# EAGLE design shoulder (EAGLE 7.5.0)
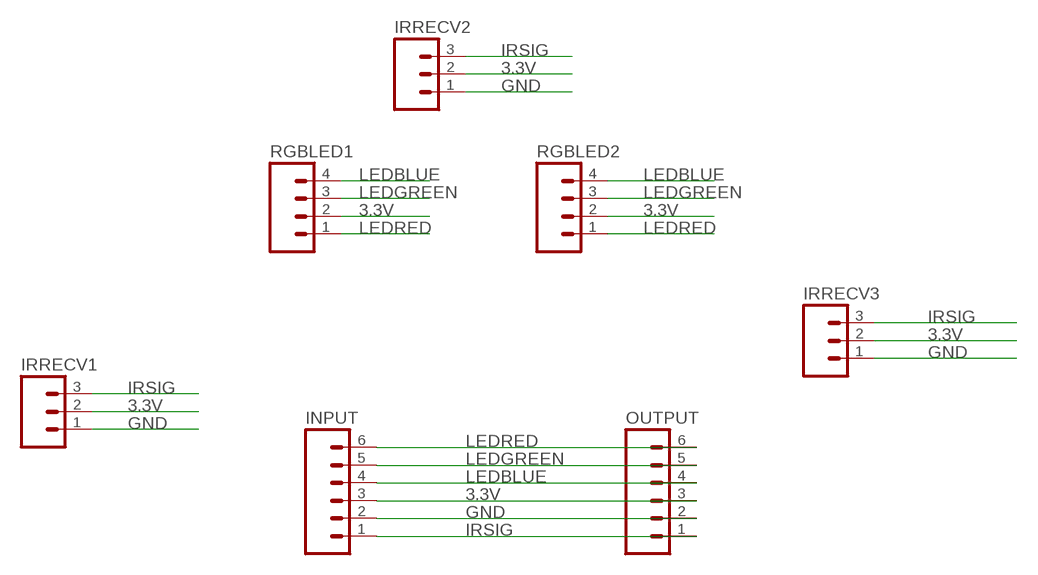
[diagram p0: schematic, sheet 1]

## Parts
INPUT  M06SILK_FEMALE_PTH  [1X06]
IRRECV1  M03PTH  [1X03]
IRRECV2  M03PTH  [1X03]
IRRECV3  M03PTH  [1X03]
OUTPUT  M06SILK_FEMALE_PTH  [1X06]
RGBLED1  M04PTH  [1X04]
RGBLED2  M04PTH  [1X04]

## Nets
3.3V: INPUT.3 IRRECV1.2 IRRECV2.2 IRRECV3.2 OUTPUT.3 RGBLED1.2 RGBLED2.2
GND: INPUT.2 IRRECV1.1 IRRECV2.1 IRRECV3.1 OUTPUT.2
IRSIG: INPUT.1 IRRECV1.3 IRRECV2.3 IRRECV3.3 OUTPUT.1
LEDBLUE: INPUT.4 OUTPUT.4 RGBLED1.4 RGBLED2.4
LEDGREEN: INPUT.5 OUTPUT.5 RGBLED1.3 RGBLED2.3
LEDRED: INPUT.6 OUTPUT.6 RGBLED1.1 RGBLED2.1

## Library data of the parts
INPUT OUTPUT = SparkFun-Connectors:M06: Header 6 Standard 6-pin 0.1" header. Use with straight break away headers (SKU : PRT-00116), right angle break away headers (PRT-00553), swiss pins (PRT-00743), machine pins (PRT-00117), and female headers (PRT-00115). Molex polarized connector foot print use with SKU : PRT-08094 with associated crimp pins and housings. NOTES ON THE VARIANTS LOCK and LOCK_LONGPADS... This footprint was designed to help hold the alignment of a through-hole component (i.e. 6-pin header) while soldering it into place. You may notice that each hole has been shifted either up or down by 0.005 of an inch from it's more standard position (which is a perfectly straight line). This slight alteration caused the pins (the squares in the middle) to touch the edges of the holes. Because they are alternating, it causes a "brace" to hold the component in place. 0.005 has proven to be the perfect amount of "off-center" position when using our standard breakaway headers. Although looks a little odd when you look at the bare footprint, once you have a header in there, the alteration is very hard to notice. Also,if you push a header all the way into place, it is covered up entirely on the bottom side. This idea of altering the position of holes to aid alignment will be further integrated into the Sparkfun Library for other footprints. It can help hold any component with 3 or more connection pins.; PROD_ID: CONN-08437
IRRECV1-IRRECV3 = SparkFun-Connectors:M03: Header 3 Standard 3-pin 0.1" header. Use with straight break away headers (SKU : PRT-00116), right angle break away headers (PRT-00553), swiss pins (PRT-00743), machine pins (PRT-00117), and female headers (PRT-00115). Molex polarized connector foot print use with SKU : PRT-08232 with associated crimp pins and housings.
RGBLED1 RGBLED2 = SparkFun-Connectors:M04: Header 4 Standard 4-pin 0.1" header. Use with straight break away headers (SKU : PRT-00116), right angle break away headers (PRT-00553), swiss pins (PRT-00743), machine pins (PRT-00117), and female headers (PRT-00115). Molex polarized connector foot print use with SKU : PRT-08231 with associated crimp pins and housings. 1MM SMD Version SKU: PRT-10208; PROD_ID: CONN-09696

## Net classes
0 default: width 0.406 mm, drill 0.381 mm, clearance 0.305 mm

## Board
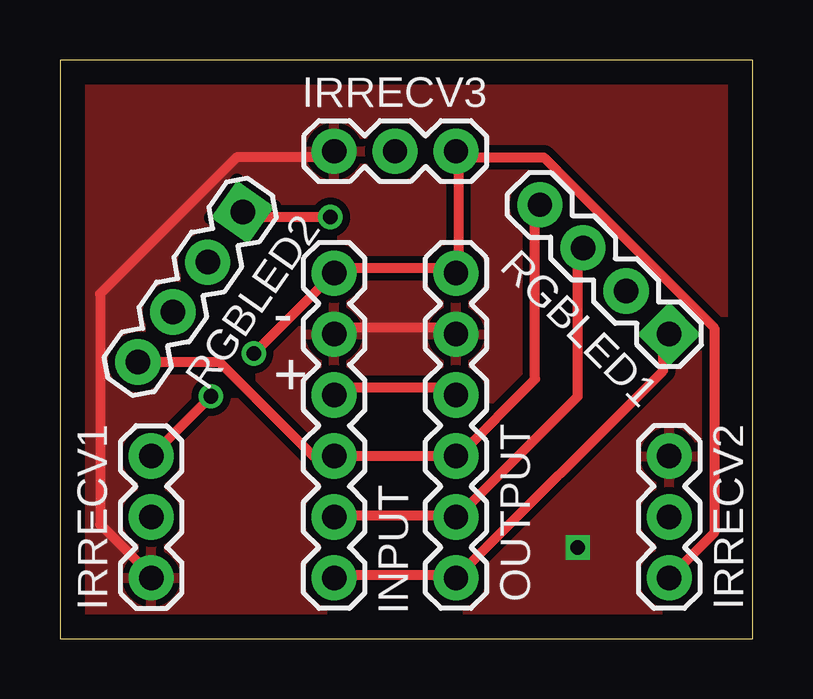
[diagram p1: board, top side]
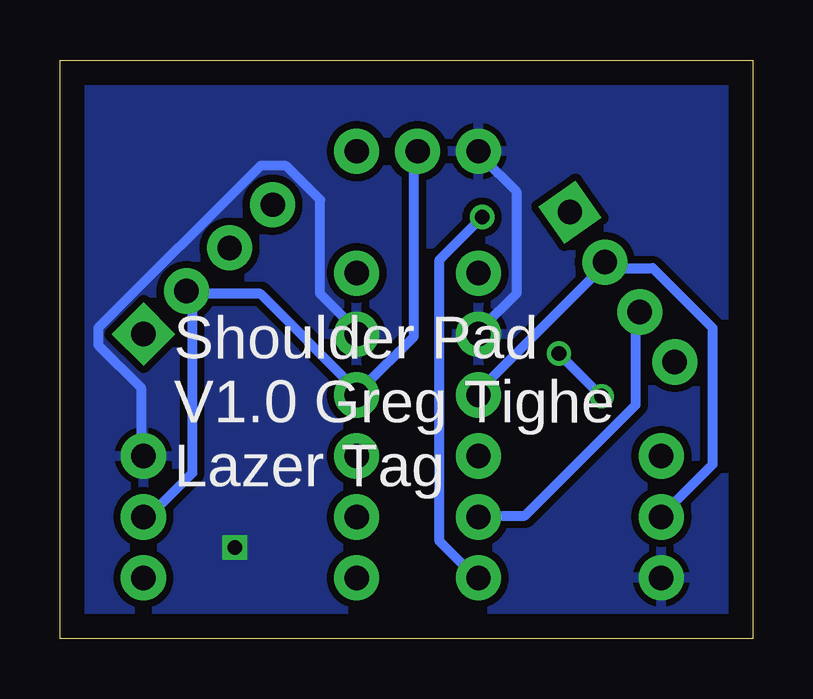
[diagram p2: board, bottom side, seen from below]

Size 28.88 x 24.12 mm. Coordinates in mm from the lower left corner, seen from the top.
Outline: 0,0 28.88,0 28.88,24.12 0,24.12 0,0
Copper layers (1*16): Top 0.035mm / dielectric 1.5mm / Bottom 0.035mm
Design rules "default": minimum track width 10mil, minimum drill 24mil, track to track 8mil, track to pad 8mil, pad to pad 8mil, via to via 8mil, smd to smd 8mil, copper to edge 40mil, drill to drill 8mil, minimum pad ring 10mil, minimum via ring 8mil, stop-mask expansion 4mil, vias tented up to drill 0mil, thermal gap 10mil

### Footprints (pad centres in the part's own frame; a part is rotated, then mirrored left to right if it is on the bottom)
1X06 = drill 1.016 pad 1.88: 1 0,0; 2 2.54,0; 3 5.08,0; 4 7.62,0; 5 10.16,0; 6 12.7,0
1X03 = drill 1.016 pad 1.88: 1 0,0; 2 2.54,0; 3 5.08,0
1X04 = drill 1.016 pad 1.88 square: 1 0,0 | drill 1.016 pad 1.88: 2 2.54,0; 3 5.08,0; 4 7.62,0

### Placement (x,y rotation side)
INPUT  11.43,15.24 270 top
IRRECV1  3.81,2.54 90 top
IRRECV2  25.4,7.62 270 top
IRRECV3  11.43,20.32 0 top
OUTPUT  16.51,15.24 270 top
RGBLED1  25.4,12.7 135 top
RGBLED2  7.62,17.78 235 top

### Tracks (layer width: path | path; a pad name or v marks a point on that pad's centre or on a via)
3.3V
  Top 0.406: INPUT.3 11.63,10.46 16.26,10.46 OUTPUT.3
  Bottom 0.406: IRRECV1.2 3.81,5.13 1.68,7.26 1.68,12.95 4.17,15.44 5.94,15.44 RGBLED2.2 6.3,15.44 11.28,10.46 INPUT.3 | IRRECV3.2 14.12,20.07 14.12,12.6 16.26,10.46 OUTPUT.3 16.61,10.46 20.52,14.38 23.37,14.38 | 23.37,14.38 23.37,6.91 25.15,5.13 IRRECV2.2 | 23.37,14.38 RGBLED1.2
GND  (via drill 0.6)
  Top 0.406: INPUT.2 11.63,12.95 16.26,12.95 OUTPUT.2 | IRRECV1.1 3.81,2.64 1.68,4.78 1.68,14.38 7.37,20.07 11.28,20.07 IRRECV3.1
  Bottom 0.406: IRRECV2.1 25.5,7.62 25.5,10.46 27.28,12.24 27.28,12.95 20.52,19.71 19.46,19.71 18.03,18.29 18.03,14.38 16.61,12.95 OUTPUT.2 | INPUT.2 11.28,12.95 9.86,14.38 9.86,18.64 11.28,20.07 IRRECV3.1
  other vias: 21.59,3.81
  pour Top: 0,24.13 29.21,24.13 29.21,0 0,0
  pour Bottom: 0,24.13 29.21,24.13 29.21,0 0,0
IRSIG  (via drill 0.61)
  Top 0.406: v6.3,10.11 IRRECV1.3 | v8.08,11.89 INPUT.1 11.63,15.44 16.26,15.44 OUTPUT.1 16.61,15.44 16.61,20.07 | IRRECV2.3 27.28,4.42 27.28,12.95 20.17,20.07 16.61,20.07 | 16.61,20.07 IRRECV3.3
  Bottom 0.406: v8.08,11.89 v6.3,10.11
LEDBLUE
  Top 0.406: RGBLED2.4 3.45,11.53 6.65,11.53 10.57,7.62 INPUT.4 OUTPUT.4 16.61,7.62 19.81,10.82 19.81,17.93 RGBLED1.4
LEDGREEN
  Top 0.406: INPUT.5 11.63,5.13 16.26,5.13 OUTPUT.5 16.61,5.13 21.59,10.11 21.59,16.15 RGBLED1.3
  Bottom 0.406: RGBLED2.3 4.88,13.31 4.88,9.75 9.5,5.13 11.28,5.13 INPUT.5
LEDRED  (via drill 0.61)
  Top 0.406: INPUT.6 11.63,2.64 16.26,2.64 OUTPUT.6 25.15,11.18 25.15,12.6 RGBLED1.1 | v11.28,17.58 7.72,17.58 RGBLED2.1
  Bottom 0.406: v11.28,17.58 13.06,15.8 13.06,4.06 11.63,2.64 INPUT.6

### Text on the board
tNames: - | +
bNames: Shoulder Pad / V1.0 Greg Tighe / Lazer Tag